# Altium schematic sheet IO.SchDoc
size A4
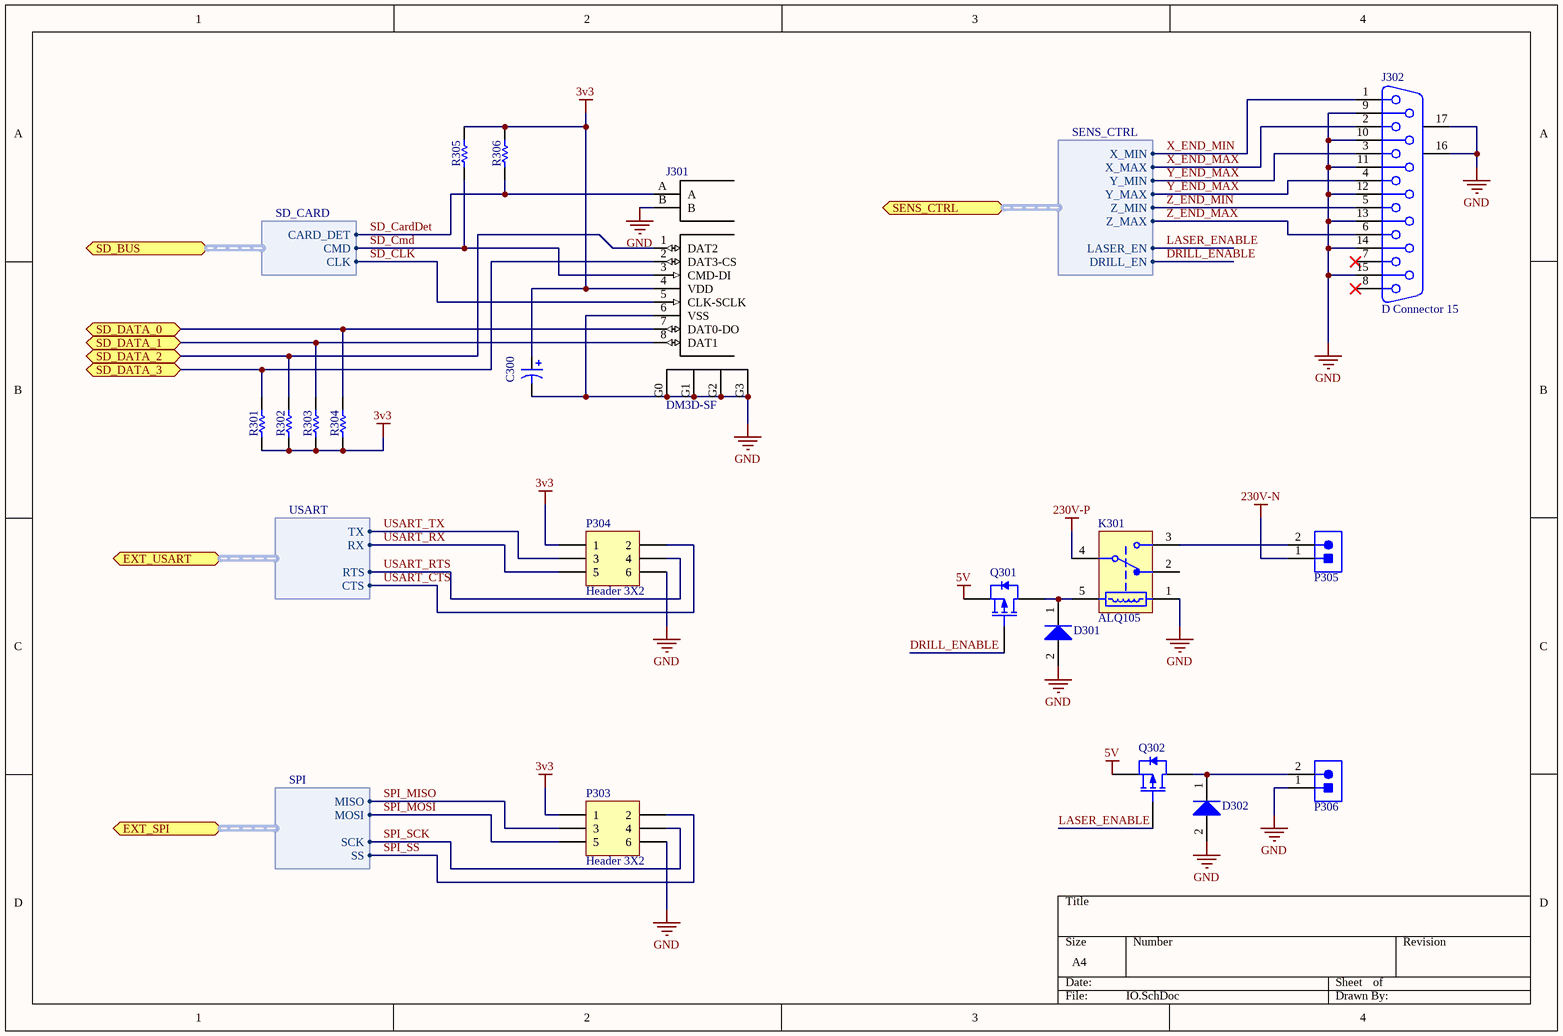
[diagram p0: IO.SchDoc]

## Parts
C300  T491B  [B]  (value not drawn)
D301  NSR0340HT1G  [ONSC-SOD-323-2-477-02_V]  (value not drawn)
D302  NSR0340HT1G  [ONSC-SOD-323-2-477-02_V]  (value not drawn)
J301  DM3D-SF  [DM3D-SF]
J302  D Connector 15  [DSUB1.385-2H15]
K301  ALQ105  [PNSC-LQ-5-2000x1000x1600_V]
P303  Header 3X2  [HDR2X3]
P304  Header 3X2  [HDR2X3]
P305  SCREW-5.0/5.08 2WAYS  [SCREW-5.0-2WAYS_V]  (value not drawn)
P306  SCREW-5.0/5.08 2WAYS  [SCREW-5.0-2WAYS_V]  (value not drawn)
Q301  BSS84  [SOT23_N]  (value not drawn)
Q302  BSS84  [SOT23_N]  (value not drawn)
R301  1K 5% 1206(3216)  [RESC1206(3216)_N]  (value not drawn)
R302  1K 5% 1206(3216)  [RESC1206(3216)_N]  (value not drawn)
R303  1K 5% 1206(3216)  [RESC1206(3216)_N]  (value not drawn)
R304  1K 5% 1206(3216)  [RESC1206(3216)_N]  (value not drawn)
R305  1K 5% 1206(3216)  [RESC1206(3216)_N]  (value not drawn)
R306  1K 5% 1206(3216)  [RESC1206(3216)_N]  (value not drawn)

## Ports
EXT_SPI (harness SPI), EXT_USART (harness USART), SD_BUS (harness SD_CARD), SD_DATA_0 (bidir), SD_DATA_1 (bidir), SD_DATA_2 (bidir), SD_DATA_3 (bidir), SENS_CTRL (harness SENS_CTRL)

## Harnesses
SENS_CTRL: X_MIN, X_MAX, Y_MIN, Y_MAX, Z_MIN, Z_MAX, LASER_EN, DRILL_EN
USART: TX, RX, RTS, CTS
SPI: MISO, MOSI, SCK, SS
SD_CARD: CARD_DET, CMD, CLK

## Nets
3v3: C300.1 J301.4(VDD) P303.1 P304.1 R301.1 R302.1 R303.1 R304.1 R305.2 R306.2
5V: Q301.2(S) Q302.2(S)
230V-N: P305.1
230V-P: K301.4(COM)
GND: C300.2 D301.2(A) D302.2(A) J301.6(VSS) J301.B J301.G0 J301.G1 J301.G2 J301.G3 J302.9 J302.10 J302.11 J302.12 J302.13 J302.14 J302.15 J302.16(MH1) J302.17(MH2) K301.1 P303.6 P304.6 P306.1
DRILL_ENABLE: Q301.1(G) ; port SENS_CTRL.DRILL_EN
LASER_ENABLE: Q302.1(G) ; port SENS_CTRL.LASER_EN
SD_CardDet: J301.A R306.1 ; port SD_BUS.CARD_DET
SD_CLK: J301.5(CLK-SCLK) ; port SD_BUS.CLK
SD_Cmd: J301.3(CMD-DI) R305.1 ; port SD_BUS.CMD
SD_DATA_0: J301.7(DAT0-DO) R304.2 ; port SD_DATA_0
SD_DATA_1: J301.8(DAT1) R303.2 ; port SD_DATA_1
SD_DATA_2: J301.1(DAT2) R302.2 ; port SD_DATA_2
SD_DATA_3: J301.2(DAT3-CS) R301.2 ; port SD_DATA_3
SPI_MISO: P303.3 ; port EXT_SPI.MISO
SPI_MOSI: P303.5 ; port EXT_SPI.MOSI
SPI_SCK: P303.4 ; port EXT_SPI.SCK
SPI_SS: P303.2 ; port EXT_SPI.SS
USART_CTS: P304.2 ; port EXT_USART.CTS
USART_RTS: P304.4 ; port EXT_USART.RTS
USART_RX: P304.5 ; port EXT_USART.RX
USART_TX: P304.3 ; port EXT_USART.TX
X_END_MAX: J302.2 ; port SENS_CTRL.X_MAX
X_END_MIN: J302.1 ; port SENS_CTRL.X_MIN
Y_END_MAX: J302.3 J302.4 ; port SENS_CTRL.Y_MIN, port SENS_CTRL.Y_MAX
Z_END_MAX: J302.6 ; port SENS_CTRL.Z_MAX
Z_END_MIN: J302.5 ; port SENS_CTRL.Z_MIN
NetD301_1: D301.1(K) K301.5 Q301.3(D)
NetD302_1: D302.1(K) P306.2 Q302.3(D)
NetK301_3: K301.3(NO) P305.2

Not connected (* = marked no-connect by the designer): J302 7* 8*; K301 2(NC)

## Library data of the parts
C300 = T491B: Solid Tantalum Chip Capacitor, Standard T491 Series - Industrial Grade; Value: 100pF; Published: 17-Jul-2002; LatestRevisionDate: 19-Mar-2004; LatestRevisionNote: Silkscreen dimensions re-sized.; DatasheetDocument: Mar-2001; PackageDocument: Mar-2001; PackageReference: B; Publisher: Altium Limited; Code_JEITA: 3528-21; ComponentLink1Description: Manufacturer Link; ComponentLink1URL: http://www.kemet.com/; ComponentLink2Description: Datasheet; ComponentLink2URL: http://www.kemet.com/kemet/web/homepage/kechome.nsf/vapubfilesname/F3102TA.pdf/$file/F3102TA.pdf
D301 D302 = CMP-1055-00472-1: Schottky Barrier Diode, 2-Pin SOD-323, Pb-Free, Tape and Reel; Manufacturer: On Semiconductor; IFSM Max (A): 1; Configuration: Single; PackageDescription: 2-Pin SOD, Body 1.7 x 1.25 mm; ComponentLink2Description: Datasheet; PartNumber: NSR0340HT1G; ComponentLink3URL: http://www.onsemi.com/pub_link/Collateral/477-02.PDF.1; Packing: Tape and Reel; PackageVersion: Rev. H, 03/2007; ComponentLink1URL: http://www.onsemi.com/; ComponentLink2URL: http://www.onsemi.cn/pub_link/Collateral/NSR0340H-D.PDF; ComponentLink3Description: Package Specification; ComponentLink1Description: Manufacturer URL; Mounting Technology: Surface Mount; RoHS: TRUE; PackageReference: SOD-323-2-477-02; DatasheetVersion: Rev. 1
J302 = D Connector 15: Receptacle Assembly, 15 Position, Right Angle; PackageDocument: O; Positions: 15; Published: 15-Jun-2001; LatestRevisionDate: 17-Jul-2002; LatestRevisionNote: Re-released for DXP Platform.; DatasheetDocument: 1-Sep-99; PackageReference: 788757; Publisher: Altium Limited; Orientation: Right Angle; Gender: Receptacle
K301 = CMP-1503-00191-1: LQ Relays, 5 V Coil Voltage, 400 mW Nominal Operating Power, -40 to 85 degC, 5-Pin LQ, Carton, Case, RoHS; Manufacturer: Panasonic; Coil Voltage: 5 V; Max Switching Voltage: 250 V AC; Mechanical Life(Min.operation): 1x10^7; Electrical Life: 5x10^4; Pb-Free: True; Nominal Operating Power: 400 mW; Max Switching Current: 10 A (N.O.), 3 A (N.C.); RoHS: True; PackageReference: LQ-5-2000x1000x1600; Packing: Carton, Case; PackageDescription: 5-Pin Through Hole Terminal Package, Body 20 x 10 mm; ComponentLink1Description: Manufacturer URL; ComponentLink3Description: Package Specification; DatasheetVersion: 201410-T; ComponentLink1URL: http://www3.panasonic.biz/ac/ae/index.jsp; ComponentLink3URL: http://www3.panasonic.biz/ac/e_download/control/relay/power/catalog/mech_eng_lq.pdf?f_cd=401220; PartNumber: ALQ105; Mounting Technology: Through Hole; ComponentLink2Description: Datasheet; Series: LQ Relays; ComponentLink2URL: http://www3.panasonic.biz/ac/e_download/control/relay/power/catalog/mech_eng_lq.pdf?f_cd=401220; PackageVersion: ASCTB92E, 10/2014
P303 P304 = Header 3X2: Header, 3-Pin, Dual row; LatestRevisionDate: 17-Jul-2002; LatestRevisionNote: Re-released for DXP Platform.; Publisher: Altium Limited
P305 P306 = CMP-0617-00009-1: Socket, Screw Terminal Block, 2 Way, 5.0 mm Pitch, 90 Degree Angle, Through-Hole; Manufacturer: No Vendor; Insulation Resistance: 5000 MOhm / 1000 V; Contact Resistance: 20 mOhm; Rated Current: 25 A; Poles: 2; Rated Voltage: 300 V; PartNumber: SCREW-5.0/5.08 2WAYS; ComponentLink1Description: Datasheet; ComponentLink1URL: 5mm screw terminal in SVN; Mounting Technology: Through Hole; PackageDescription: Socket, Screw Terminal Block, 2 Way, Pitch 5 mm, 90 Degree Angle, Through-Hole; Temperature Range: -40 to 105 degC
Q301 Q302 = BSS84: P-channel Enhancement Mode Vertical D-MOSFET; Published: 17-Sep-2003; LatestRevisionDate: 12-Dec-2006; LatestRevisionNote: IPC-7351 Footprint Added.; DatasheetVersion: 18-Jun-1997; PackageVersion: May-1999; PackageReference: SOT23; Publisher: Altium Limited; PackageDescription: 3-Pin SOT-23 Package 0.95 mm Pitch, 2.3 mm Lead Span; ComponentLink1Description: Manufacturer Link; ComponentLink1URL: http://www.semiconductors.philips.com/; ComponentLink2Description: Datasheet; ComponentLink2URL: http://www.semiconductors.philips.com/acrobat/datasheets/BSS84_3.pdf
R301-R306 = CMP-1014-00074-1: 1K 0.25W 5% 1206 (3216 Metric)  SMD; Value: 1000.00 Ohm; Case-Metric: 3216; Case-EIA: 1206; Tolerance: 5 %; Power: 0.25 W; Technology: SMT